# Altium schematic sheet LAN-PWR.SchDoc
size A2
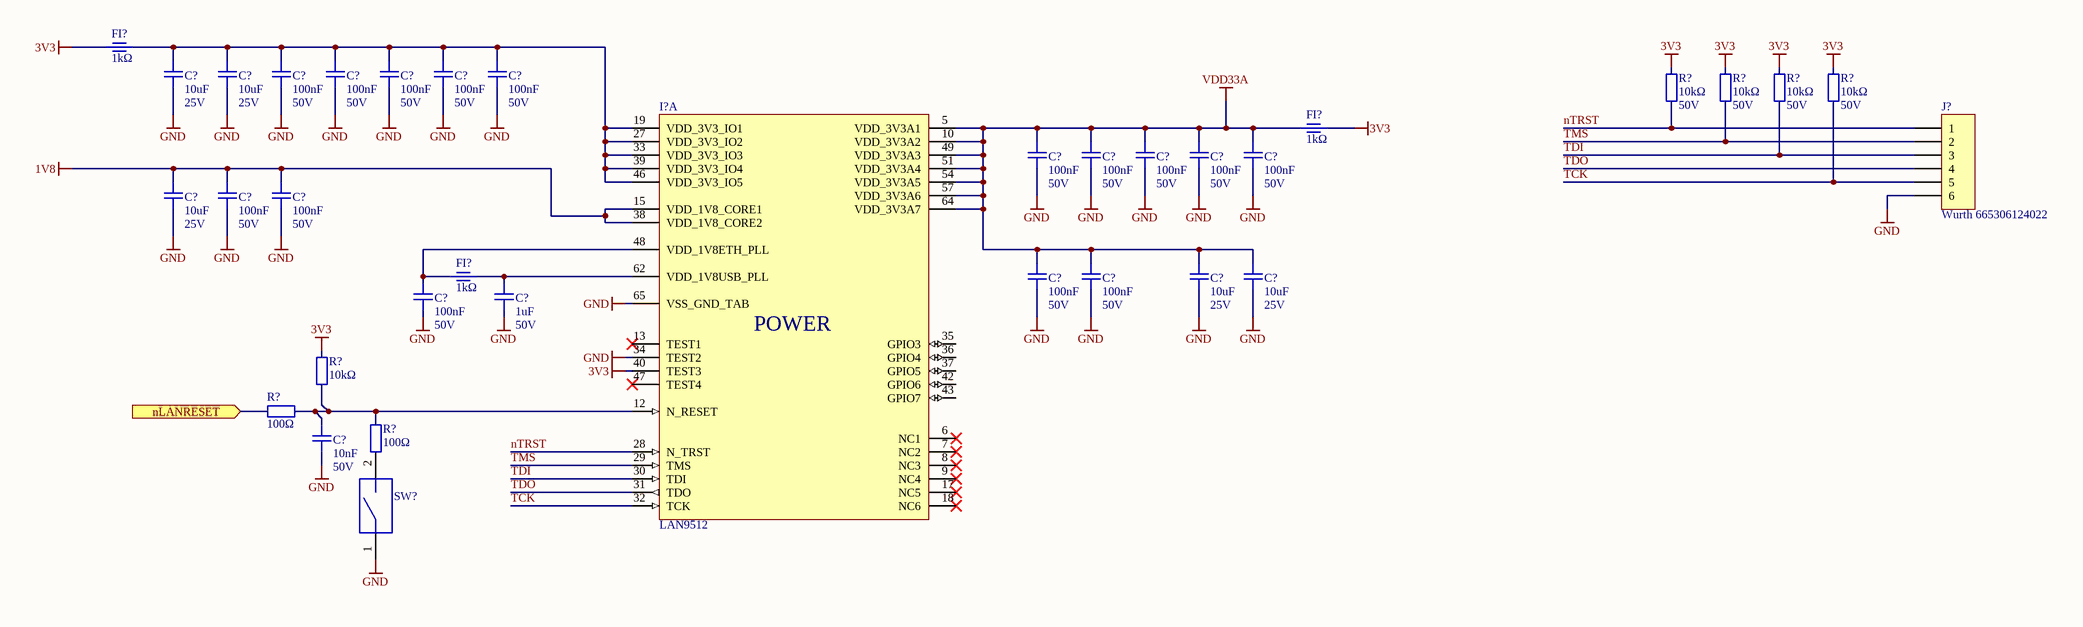
[diagram p0: LAN-PWR.SchDoc]

## Parts
(Parts that share a designator on the sheet are numbered #1, #2 ... from top to bottom, then left to right.)
C?#1  Voltage: 25V  [C0603M_1709282117]  (hidden comment: 10uF)
C?#2  Voltage: 25V  [C0603M_1709282117]  (hidden comment: 10uF)
C?#3  Voltage: 50V  [C0603M_1709282117]  (hidden comment: 100nF)
C?#4  Voltage: 50V  [C0603M_1709282117]  (hidden comment: 100nF)
C?#5  Voltage: 50V  [C0603M_1709282117]  (hidden comment: 100nF)
C?#6  Voltage: 50V  [C0603M_1709282117]  (hidden comment: 100nF)
C?#7  Voltage: 50V  [C0603M_1709282117]  (hidden comment: 100nF)
C?#8  Voltage: 50V  [C0603M_1709282117]  (hidden comment: 100nF)
C?#9  Voltage: 50V  [C0603M_1709282117]  (hidden comment: 100nF)
C?#10  Voltage: 50V  [C0603M_1709282117]  (hidden comment: 100nF)
C?#11  Voltage: 50V  [C0603M_1709282117]  (hidden comment: 100nF)
C?#12  Voltage: 50V  [C0603M_1709282117]  (hidden comment: 100nF)
C?#13  Voltage: 25V  [C0603M_1709282117]  (hidden comment: 10uF)
C?#14  Voltage: 50V  [C0603M_1709282117]  (hidden comment: 100nF)
C?#15  Voltage: 50V  [C0603M_1709282117]  (hidden comment: 100nF)
C?#16  Voltage: 50V  [C0603M_1709282117]  (hidden comment: 100nF)
C?#17  Voltage: 50V  [C0603M_1709282117]  (hidden comment: 100nF)
C?#18  Voltage: 25V  [C0603M_1709282117]  (hidden comment: 10uF)
C?#19  Voltage: 25V  [C0603M_1709282117]  (hidden comment: 10uF)
C?#20  Voltage: 50V  [C0603M_1709282117]  (hidden comment: 100nF)
C?#21  Voltage: 50V  [C0603M_1709282117]  (hidden comment: 1uF)
C?#22  Voltage: 50V  [C0603M_1709282117]  (hidden comment: 10nF)
FI?#1  1kΩ  [L0805M_1708232324]
FI?#2  1kΩ  [L0805M_1708232324]
FI?#3  1kΩ  [L0805M_1708232324]
I?  LAN9512  [QFN64_1706282152]  (part A of 3)
J?  Article: Wurth 665306124022  [WTB_WURTH_665306124022_1709042341]  (hidden comment: connector_6p_1709042336)
R?#1  Voltage: 50V  [R0603M_RESC1608X06N]  (hidden comment: 10kΩ)
R?#2  Voltage: 50V  [R0603M_RESC1608X06N]  (hidden comment: 10kΩ)
R?#3  Voltage: 50V  [R0603M_RESC1608X06N]  (hidden comment: 10kΩ)
R?#4  Voltage: 50V  [R0603M_RESC1608X06N]  (hidden comment: 10kΩ)
R?#5  10kΩ  [R0603M_RESC1608X06N]
R?#6  100Ω  [R0603M_RESC1608X06N]
R?#7  100Ω  [R0603M_RESC1608X06N]
SW?  (no value)  [TACT_2.5x3_OMRON_B3U-1000P]

## Ports
nLANRESET (in)

## Nets
1V8: C?#13.2 C?#14.2 C?#15.2 I?.15(VDD_1V8_CORE1) I?.38(VDD_1V8_CORE2)
3V3: FI?#1.1 FI?#2.2 I?.40(TEST3) R?#1.2 R?#2.2 R?#3.2 R?#4.2 R?#5.2
GND: C?#1.1 C?#2.1 C?#3.1 C?#4.1 C?#5.1 C?#6.1 C?#7.1 C?#8.1 C?#9.1 C?#10.1 C?#11.1 C?#12.1 C?#13.1 C?#14.1 C?#15.1 C?#16.1 C?#17.1 C?#18.1 C?#19.1 C?#20.1 C?#21.1 C?#22.1 I?.34(TEST2) I?.65(VSS_GND_TAB) J?.6 SW?.1
VDD33A: C?#8.2 C?#9.2 C?#10.2 C?#11.2 C?#12.2 C?#16.2 C?#17.2 C?#18.2 C?#19.2 FI?#2.1 I?.5(VDD_3V3A1) I?.10(VDD_3V3A2) I?.49(VDD_3V3A3) I?.51(VDD_3V3A4) I?.54(VDD_3V3A5) I?.57(VDD_3V3A6) I?.64(VDD_3V3A7)
nLANRESET: R?#6.1 ; port nLANRESET
nTRST: I?.28(N_TRST) J?.1 R?#1.1
TCK: I?.32(TCK) J?.5 R?#4.1
TDI: I?.30(TDI) J?.3 R?#3.1
TDO: I?.31(TDO) J?.4
TMS: I?.29(TMS) J?.2 R?#2.1
NetC?#1_2: C?#1.2 C?#2.2 C?#3.2 C?#4.2 C?#5.2 C?#6.2 C?#7.2 FI?#1.2 I?.19(VDD_3V3_IO1) I?.27(VDD_3V3_IO2) I?.33(VDD_3V3_IO3) I?.39(VDD_3V3_IO4) I?.46(VDD_3V3_IO5)
NetC?#20_2: C?#20.2 FI?#3.1 I?.48(VDD_1V8ETH_PLL)
NetC?#21_2: C?#21.2 FI?#3.2 I?.62(VDD_1V8USB_PLL)
NetC?#22_2: C?#22.2 I?.12(N_RESET) R?#5.1 R?#6.2 R?#7.2
NetR?#7_1: R?#7.1 SW?.2

Not connected (* = marked no-connect by the designer): I? 6(NC1)* 7(NC2)* 8(NC3)* 9(NC4)* 13(TEST1)* 17(NC5)* 18(NC6)* 35(GPIO3) 36(GPIO4) 37(GPIO5) 42(GPIO6) 43(GPIO7) 47(TEST4)*

## Notes on the sheet
- Title
- Size:
- Date:
- A3
- Number:
- Time:
- Revision:
- Sheet
- of
- File:
- (in symbol 040703-0001, part A) POWER

## Library data of the parts
C?#1 C?#2 C?#13 C?#18 C?#19 = 010103-0083: C# CER  10uF 20% 25V X5R 0603; TempRange: -55/85°C; PartNumber: 010103-0083; Value: 10uF; Tolerance: 20%; Package: 0603; Dielectric: X5R; Type: CER
C?#3-C?#12 C?#14-C?#17 C?#20 = 010103-0061: C# CER  100nF 10% 50V X7R 0603; TempRange: -55/125°C; PartNumber: 010103-0061; Value: 100nF; Tolerance: 10%; Package: 0603; Dielectric: X7R; Type: CER
C?#21 = 010103-0073: C# CER  1uF 10% 50V X7R 0603; TempRange: -55/125°C; PartNumber: 010103-0073; Value: 1uF; Tolerance: 10%; Package: 0603; Dielectric: X7R; Type: CER
C?#22 = 010103-0049: C# CER  10nF 10% 50V X7R 0603; TempRange: -55/125°C; PartNumber: 010103-0049; Value: 10nF; Tolerance: 10%; Package: 0603; Dielectric: X7R; Type: CER
FI?#1-FI?#3 = 010501-0020: FI# BEAD  1kΩ @  100MHz 25%  1.5A  150mΩdc 0805; TempRange: -55/125°C; PartNumber: 010501-0020; Value: 1kΩ; Frequency: 100MHz; DCValue: 150mΩdc; Current: 1.5A; Tolerance: 25%; Package: 0805; Type: BEAD
I? = 040703-0001: I# ETH USB2.0 Hub 10/100 ethernet LAN9512 QFN64; TempRange: 0/70°C; PartNumber: 040703-0001; Value: LAN9512; Info: USB2.0 Hub 10/100 ethernet; Package: QFN64
J? = 070101-0001: J# WTB 6p Male Straight Wurth 665306124022; PartNumber: 070101-0001; Gender: Male; Direction: Straight
R?#1-R?#4 = 010201-0038: R# FIX  10kΩ 1% 100mW 0603; TempRange: -55/155°C; PartNumber: 010201-0038; Value: 10kΩ; Tolerance: 1%; Power: 100mW; Package: 0603; Type: FIX
R?#5 = 010201-0038: R# FIX  10kΩ 1% 100mW 0603; Voltage: 50V; TempRange: -55/155°C; PartNumber: 010201-0038; Value: 10kΩ; Tolerance: 1%; Power: 100mW; Package: 0603; Type: FIX
R?#6 R?#7 = 010201-0014: R# FIX  100Ω 1% 100mW 0603; Voltage: 50V; TempRange: -55/155°C; PartNumber: 010201-0014; Value: 100Ω; Tolerance: 1%; Power: 100mW; Package: 0603; Type: FIX
SW? = 080103-0003: S# PUSH 50mA 12Vdc Omron B3U-1000P; PartNumber: 080103-0003; ContactVoltageDC: 12Vdc; ContactCurrent: 50mA